# Altium schematic sheet LCD_Module.SchDoc
size A; SheetNumber: 6; SheetTotal: 6
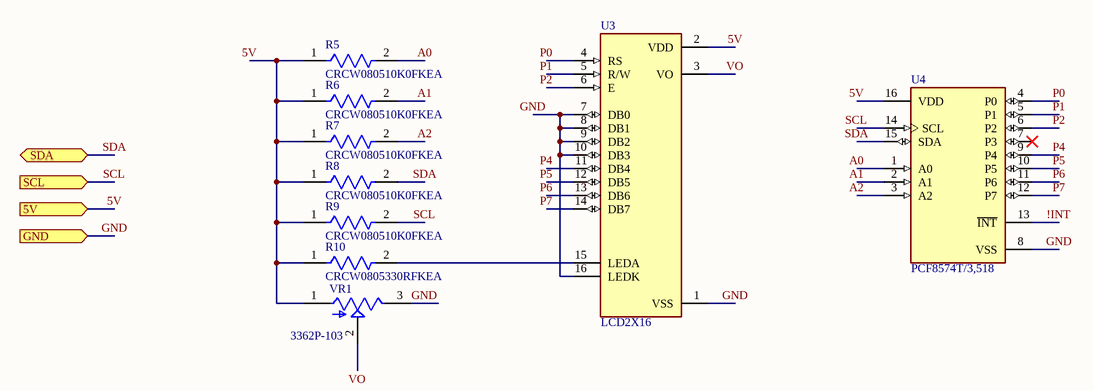
[diagram p0: LCD_Module.SchDoc]

## Parts
R5  CRCW080510K0FKEA  [FP-CRCW0805-e3-IPC_A]
R6  CRCW080510K0FKEA  [FP-CRCW0805-e3-IPC_A]
R7  CRCW080510K0FKEA  [FP-CRCW0805-e3-IPC_A]
R8  CRCW080510K0FKEA  [FP-CRCW0805-e3-IPC_A]
R9  CRCW080510K0FKEA  [FP-CRCW0805-e3-IPC_A]
R10  CRCW0805330RFKEA  [FP-CRCW0805-e3-MFG]
U3  LCD2X16  [LCD_LCD2X16]
U4  PCF8574T/3,518  [FP-SOT162-1-MFG]
VR1  3362P-103  [TRIM_3362P-103]

## Ports
5V (in), GND (in), SCL (in), SDA (bidir)

## Nets
5V: R5.1 R6.1 R7.1 R8.1 R9.1 R10.1 U3.2(VDD) U4.16(VDD) VR1.1(CCW) ; port 5V
!INT: U4.13(~{INT})
A0: R5.2 U4.1(A0)
A1: R6.2 U4.2(A1)
A2: R7.2 U4.3(A2)
GND: U3.1(VSS) U3.7(DB0) U3.8(DB1) U3.9(DB2) U3.10(DB3) U3.16(LEDK) U4.8(VSS) VR1.3(CW) ; port GND
P0: U3.4(RS) U4.4(P0)
P1: U3.5(R/W) U4.5(P1)
P2: U3.6(E) U4.6(P2)
P4: U3.11(DB4) U4.9(P4)
P5: U3.12(DB5) U4.10(P5)
P6: U3.13(DB6) U4.11(P6)
P7: U3.14(DB7) U4.12(P7)
SCL: R9.2 U4.14(SCL) ; port SCL
SDA: R8.2 U4.15(SDA) ; port SDA
VO: U3.3(VO) VR1.2(WIPER)
NetR10_2: R10.2 U3.15(LEDA)

Not connected (* = marked no-connect by the designer): U4 7(P3)*

## Library data of the parts
R5-R9 = CMP-2001-04908-2: RES Thick Film, 10kΩ, 1%, 0.125W, 100ppm/°C, 0805; Resistance: 10kR; Voltage Rating (DC): 150V; Power Rating: 125mW; Weight: 0.000194oz; Package Quantity: 5000; Military Standard: Not; Max Operating Temperature: 155°C; Temperature Coefficient: 100ppm/°C; Contact Plating: Tin; Width: 1.25mm; Height: 0.45mm; Radiation Hardening: No; Tolerance: 1%; Min Operating Temperature: -55°C; Voltage Rating: 150V; Length: 2mm; Depth: 1.25mm; Termination: SMD/SMT; Packaging: Tape and Reel; Case/Package: 0805; Case Code (Metric): 2012; Lead Free: Lead Free; Case Code (Imperial): 0805; Composition: Thick Film
R10 = CMP-2001-03823-2: RES Thick Film, 330Ω, 1%, 0.125W, 100ppm/°C, 0805; Voltage Rating (DC): 150V; Resistance: 330R; Max Power Dissipation: 125mW; Mount: Surface Mount; Packaging: Tape and Reel; Min Operating Temperature: -55°C; Military Standard: Not; Case Code (Metric): 2012; Height: 0.02inch; Voltage Rating: 150V; Case/Package: 0805; Max Operating Temperature: 155°C; Width: 0.049inch; Case Code (Imperial): 0805; Termination: SMD/SMT; Lead Free: Lead Free; Contact Plating: Tin; Package Quantity: 10; Composition: Thick Film; Length: 2mm; Features: Automotive AEC-Q200; Depth: 1.25mm; Weight: 0.000194oz; Tolerance: 1%; Power Rating: 125mW; Number of Terminations: 2; Temperature Coefficient: 100ppm/°C
U3 = LCD2X16: Display; Display: LCD 2x16 characters (blue backlight); MF: mikroElektronika; SnapEDA_Link: https://www.snapeda.com/parts/LCD2X16/mikroElektronika/view-part/2472530/?ref=snap; Price: None; Package: None; Availability: Unavailable; Value: *; MP: LCD2X16
U4 = CMP-10112-000010-1: IC I/O EXPANDER I2C 8B 16SOIC; Manufacturer: NXP Semiconductors; Frequency: 100kHz; Max Supply Voltage: 6V; Standoff Height: 0.1mm; Nominal Supply Current: 40uA; Max Junction Temp: +125°C; Min Supply Voltage: 2.5V; Number Of I/Os: 8; Manufacturer Part Number: PCF8574T/3,518; Footprint Url: https://www.nxp.com/docs/en/package-information/SOT162-1.pdf; ComponentLink2URL: https://www.nxp.com/docs/en/data-sheet/PCF8574_PCF8574A.pdf; Automotive: No; Digikey Description: IC I/O EXPANDER I2C 8B 16SOIC; Mouser Description: PCF8574 Series 2.5 - 6V Remote 8-bit I/O Expander for I2C-bus - SOIC-16; Ipc Land Pattern Name: SOIC127P1032X265-16; Interface: I2C; Octopart: https://octopart.com/pcf8574t%2F3%2C518-nxp+semiconductors-10470852; Ambient Temperature Range Low: -40°C; Lead Free: Yes; Device Class L2: Interface ICs; Temperature Range High: +85°C; Device Class L1: Integrated Circuits (ICs); Package: SOT162-1; ComponentLink2Description: Datasheet; Device Class L3: I/O Expanders; Temperature: -40°C to +85°C; Ambient Temperature Range High: +85°C; Height: 2.65mm; Category: IC; RoHS: TRUE; Temperature Range Low: -40°C
VR1 = 3362P-103: Res Cermet Trimmer 50K Ohm 10% 1/2W 1(Elec)/1(Mech)Turn 2.77mm (6.6 X 6.99 X 4.7mm) Pin Thru-Hole Tube; Package: None; Price: None; Value: *; MP: 3362P-103; Availability: Unavailable